# EAGLE design 4-HCloverMedallion (EAGLE 7.5.0)
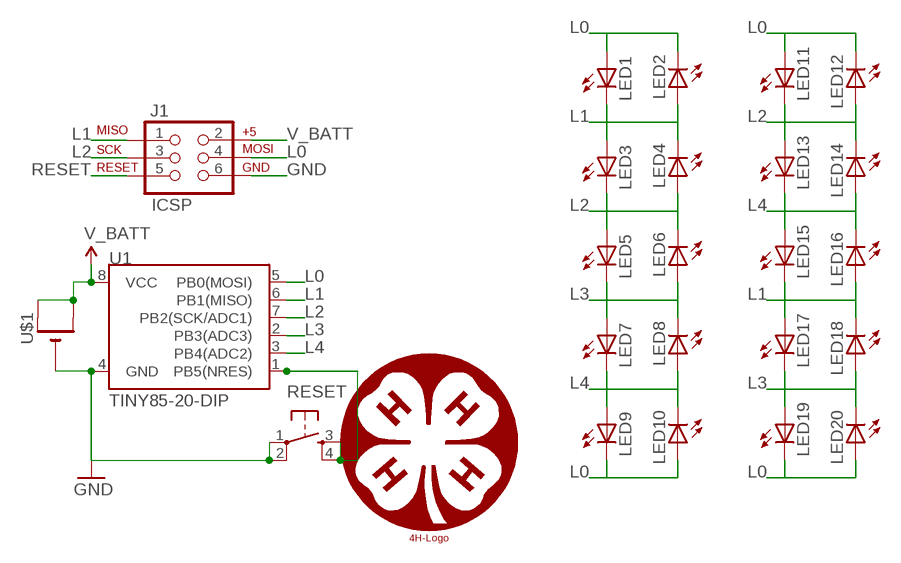
[diagram p0: schematic, sheet 1]

## Parts
J1  ICSP  AVR_SPI_PRG_6LABELED  [2X3-NS]
LED1  LED5MM  [LED5MM]
LED2  LED5MM  [LED5MM]
LED3  LED5MM  [LED5MM]
LED4  LED5MM  [LED5MM]
LED5  LED5MM  [LED5MM]
LED6  LED5MM  [LED5MM]
LED7  LED5MM  [LED5MM]
LED8  LED5MM  [LED5MM]
LED9  LED5MM  [LED5MM]
LED10  LED5MM  [LED5MM]
LED11  LED5MM  [LED5MM]
LED12  LED5MM  [LED5MM]
LED13  LED5MM  [LED5MM]
LED14  LED5MM  [LED5MM]
LED15  LED5MM  [LED5MM]
LED16  LED5MM  [LED5MM]
LED17  LED5MM  [LED5MM]
LED18  LED5MM  [LED5MM]
LED19  LED5MM  [LED5MM]
LED20  LED5MM  [LED5MM]
RESET  TAC_SWITCHPTH  [TACTILE-PTH]
U1  TINY85-20-DIP  ATTINY45TINY85-20-DIP  [DIP08]
U$1  CR2032THM  [CR2032-THRU]
U$2  4H-LOGO14  [4H_LOGO_14]

## Nets
GND: J1.6(GND) RESET.1 RESET.2 U1.4(GND) U$1.-
L0: J1.4(MOSI) LED1.A LED2.K(C) LED9.K(C) LED10.A LED11.A LED12.K(C) LED19.K(C) LED20.A U1.5(PB0(MOSI))
L1: J1.1(MISO) LED1.K(C) LED2.A LED3.A LED4.K(C) LED15.K(C) LED16.A LED17.A LED18.K(C) U1.6(PB1(MISO))
L2: J1.3(SCK) LED3.K(C) LED4.A LED5.A LED6.K(C) LED11.K(C) LED12.A LED13.A LED14.K(C) U1.7(PB2(SCK/ADC1))
L3: LED5.K(C) LED6.A LED7.A LED8.K(C) LED17.K(C) LED18.A LED19.A LED20.K(C) U1.2(PB3(ADC3))
L4: LED7.K(C) LED8.A LED9.A LED10.K(C) LED13.K(C) LED14.A LED15.A LED16.K(C) U1.3(PB4(ADC2))
RESET: J1.5(RST) RESET.3 RESET.4 U1.1(PB5(NRES))
V_BATT: J1.2(V+) U1.8(VCC) U$1.+1(+) U$1.+2(+1)

## Library data of the parts
J1 = barbary_enterprises:AVR_SPI_PRG_6: AVR ISP 6 Pin This is the reduced ISP connector for AVR programming. Common on Arduino. This footprint will take up less PCB space and can be used with a 10-pin to 6-pin adapter such as SKU: BOB-08508
LED1-LED20 = SparkFun-LED:LED: LEDs Standard schematic elements and footprints for 5mm, 3mm, 1206, and 0603 sized LEDs. 5mm - Spark Fun Electronics SKU : COM-00529 (and others)
RESET = barbary_enterprises:TAC_SWITCH: Momentary Switch Button commonly used for reset or general input. Spark Fun Electronics SKU : COM-00097 SMT- SWCH-08247
U1 = SparkFun-DigitalIC:ATTINY45: Atmel 8-pin 2/4/8kB flash uC; PROD_ID: IC-09445
U$1 = battery:CR2032
U$2 = 4h:4H-LOGO: 18 USC 707 R=51, G=153, B=102 #339966

## Board
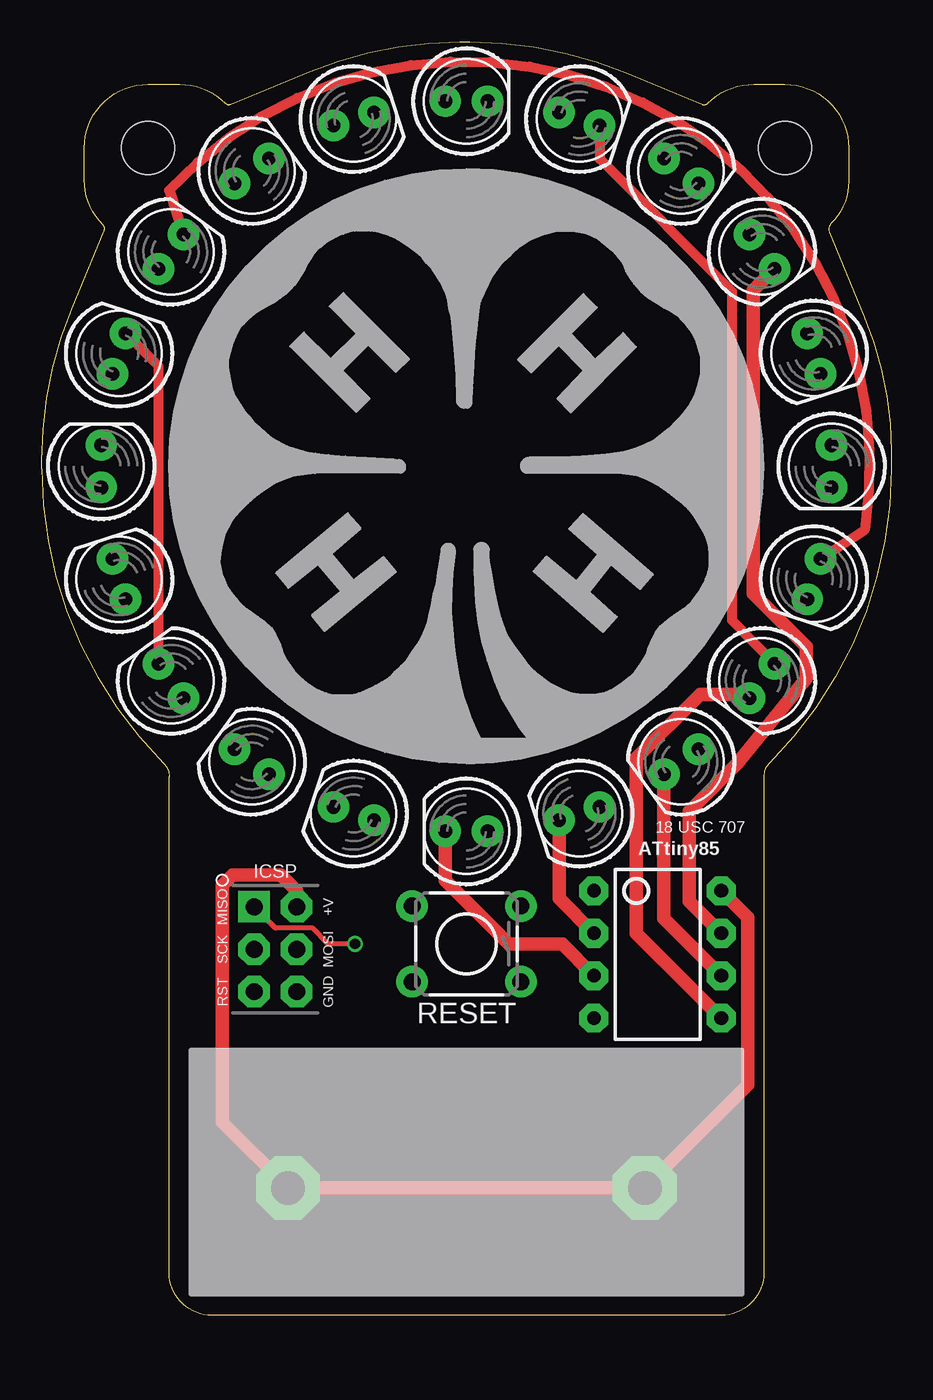
[diagram p1: board, top side]
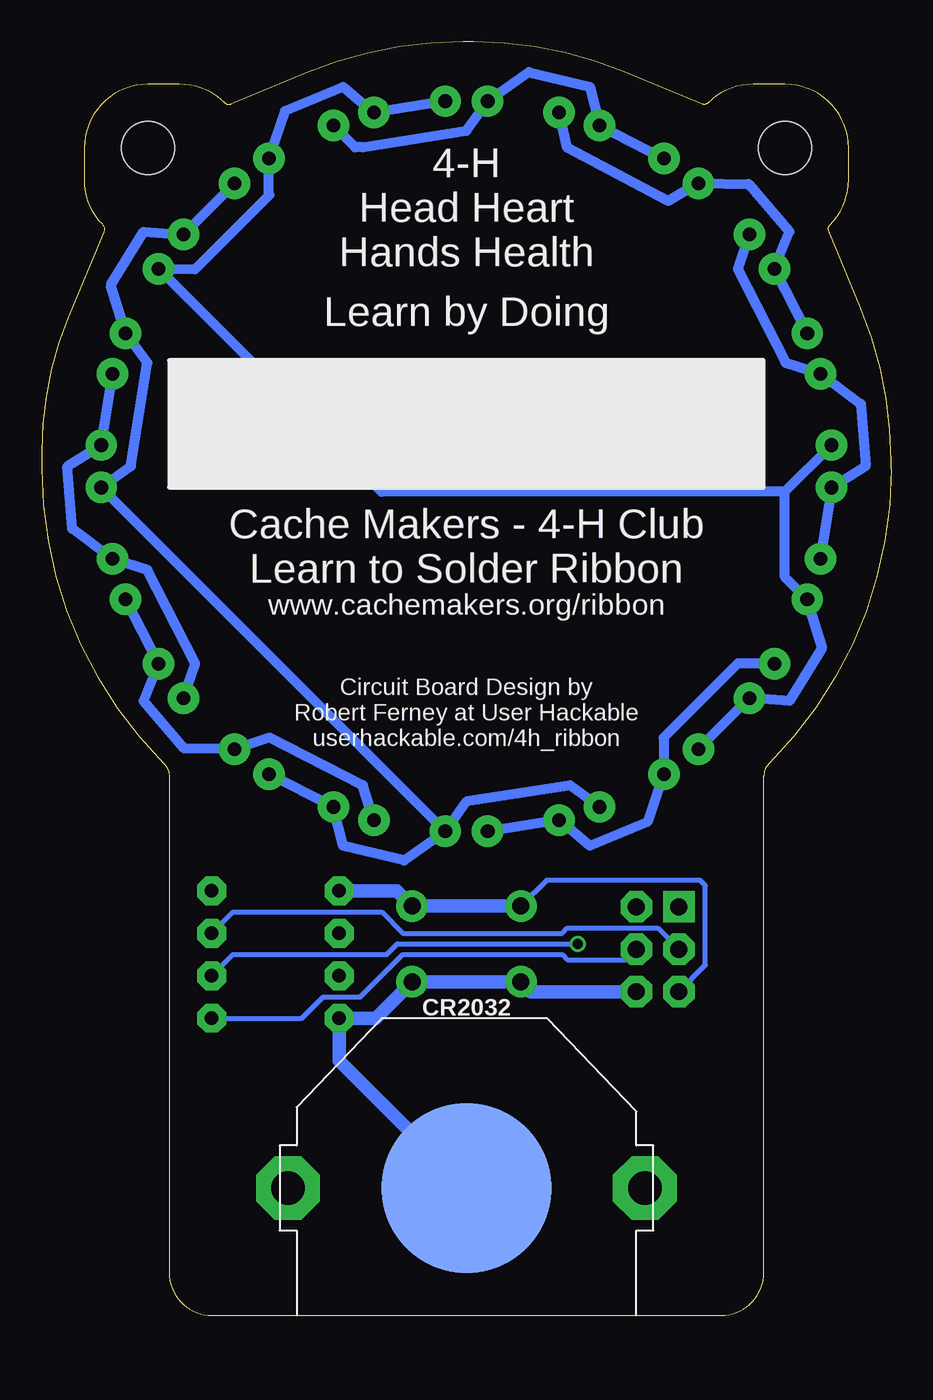
[diagram p2: board, bottom side, seen from below]

Size 50.8 x 76.2 mm. Coordinates in mm from the lower left corner, seen from the top.
Outline: 43.18,32.25 43.18,2.54 arc-90 40.64,0 10.16,0 arc-90 7.62,2.54 7.62,32.25 arc45 7.3,33.02 arc-45 0,50.65 0,51.14 arc-23 1.82,60.27 3.73,64.9 arc67 3.66,65.24 arc-45 2.54,67.95 2.54,69.85 arc-90 6.35,73.66 8.25,73.66 arc-45 10.96,72.54 arc67 11.3,72.47 15.99,74.41 arc-22 25,76.2 25.61,76.2 arc-22 34.96,74.34 39.51,72.46 arc67 39.84,72.52 arc-45 42.58,73.66 44.45,73.66 arc-90 48.26,69.85 48.26,67.87 arc-45 47.2,65.3 arc67 47.1,64.81 49.2,59.73 arc-22 50.8,51.7 50.8,50.65 arc-45 43.5,33.02 arc45 43.18,32.25
Copper layers (1*16): Top 0.0356mm / dielectric 1.5011mm / Bottom 0.0356mm
Design rules "LaenPCBOrder": minimum track width 6mil, minimum drill 13mil, track to track 6mil, track to pad 6mil, pad to pad 6mil, via to via 6mil, smd to smd 6mil, copper to edge 15mil, drill to drill 6mil, minimum pad ring 7mil, minimum via ring 7mil, stop-mask expansion 3mil, vias tented up to drill 0mil, thermal gap 10mil
Holes 3.17 mm at 6.35,69.85 44.45,69.85

### Footprints (pad centres in the part's own frame; a part is rotated, then mirrored left to right if it is on the bottom)
2X3-NS = drill 1.016 pad 1.88 square: 1 -2.54,-1.27 | drill 1.016 pad 1.88 octagon: 2 -2.54,1.27; 3 0,-1.27; 4 0,1.27; 5 2.54,-1.27; 6 2.54,1.27
LED5MM = drill 0.813 pad 1.88: A -1.27,0; K 1.27,0
TACTILE-PTH = drill 1.016 pad 1.88: 1 -3.251,2.261; 2 3.251,2.261; 3 -3.251,-2.261; 4 3.251,-2.261
DIP08 = drill 0.813 pad 1.727 octagon: 1 -3.81,-3.81; 2 -1.27,-3.81; 3 1.27,-3.81; 4 3.81,-3.81; 5 3.81,3.81; 6 1.27,3.81; 7 -1.27,3.81; 8 -3.81,3.81
CR2032-THRU = drill 2 pad 3.81 octagon: +1 -10.668,0; +2 10.668,0 | smd 10.16 x 10.16: - 0,0

### Placement (x,y rotation side)
J1  13.97,21.91 270 top
LED1  47.24,50.8 270 top
LED2  46.17,57.55 288 top
LED3  43.07,63.64 306 top
LED4  38.24,68.47 324 top
LED5  32.15,71.57 342 top
LED6  25.4,72.64 0 top
LED7  18.65,71.57 18 top
LED8  12.56,68.47 36 top
LED9  7.73,63.64 54 top
LED10  4.63,57.55 72 top
LED11  3.56,50.8 90 top
LED12  4.63,44.05 108 top
LED13  7.73,37.96 126 top
LED14  12.56,33.13 144 top
LED15  18.65,30.03 162 top
LED16  25.4,28.96 180 top
LED17  32.15,30.03 198 top
LED18  38.24,33.13 216 top
LED19  43.07,37.96 234 top
LED20  46.17,44.05 252 top
RESET  25.4,22.23 180 top
U1  36.83,21.59 270 top
U$1  25.4,7.62 180 bottom
U$2  25.4,50.8 0 top

### Tracks (layer width: path | path; a pad name or v marks a point on that pad's centre or on a via)
GND
  Bottom 0.813: U$1.- 33.02,15.24 U1.4 30.84,17.78 RESET.1 RESET.2 21.55,19.37 J1.6
L0
  Top 0.61: LED9.K 7.62,67.31 arc-146 49.21,46.99 LED20.A
  Top 0.813: U1.5 35.56,22.86 35.56,33.34 39.37,37.15 42.11,37.15 LED19.K
  Bottom 0.305: U1.5 35.24,17.78 33.97,19.05 31.75,19.05 29.21,21.59 19.68,21.59 19.37,21.27 15.88,21.27 J1.4
  Bottom 0.61: LED19.K 41.63,39.01 44.48,44.6 LED20.A 48.98,47.06 49.28,50.8 LED1.A LED2.K | LED9.K 9.17,62.59 6.32,57 LED10.A 1.82,54.53 1.52,50.8 LED11.A LED12.K
L1  (via drill 0.6)
  Top 0.305: v18.73,22.23 17.14,22.23 16.19,23.18 13.97,23.18 J1.1
  Top 0.813: LED18.K 37.21,23.75 U1.6
  Bottom 0.305: v18.73,22.23 29.53,22.23 30.16,21.59 39.37,21.59 U1.6
  Bottom 0.61: LED4.K LED3.A 44.72,64.83 46.67,61.64 LED2.A 44.48,57 45.47,50.8 LED1.K LED16.A | LED15.K 19.2,31.72 25.4,30.73 LED16.A | LED16.A 29.14,27.22 32.78,28.09 LED17.A LED18.K
L2
  Top 0.813: U1.7 38.73,24.77 38.73,30.16 41.59,33.02 45.72,38.1 45.72,40.01 42.55,43.18 42.55,61.34 LED3.K
  Bottom 0.305: J1.3 13.97,23.18 19.37,23.18 19.68,22.86 29.21,22.86 30.48,24.13 39.37,24.13 U1.7
  Bottom 0.61: LED6.K LED5.A 32.78,73.51 36.24,72.07 LED4.A 37.21,67.05 37.19,67.03 41.63,62.59 LED3.K 30.48,49.28 6.35,49.28 | LED14.K LED13.A 6.08,36.77 4.13,39.96 LED12.A 6.35,44.17 6.35,49.28 | 6.35,49.28 LED11.K
L3
  Top 0.61: 17.78,70.84 LED7.A | LED5.K 33.36,69.19 41.27,61.28 41.27,41.59 LED19.A
  Top 0.813: U1.2 30.94,24.94 LED17.K
  Bottom 0.61: LED20.K LED19.A 44.72,36.77 42.28,33.92 LED18.A 37.19,34.57 31.6,31.72 LED17.K | LED8.K LED7.A 18.02,73.51 21.66,74.38 LED6.A 25.4,70.87 31.6,69.88 32.06,69.88 LED5.K
L4
  Top 0.61: LED13.K 6.98,56.79 LED10.K
  Top 0.813: U1.3 31.11,22.23 27.94,22.23 24.13,26.04 LED16.K
  Bottom 0.61: LED10.K LED9.A 6.08,64.83 8.52,67.68 LED8.A 13.34,66.67 19.37,69.85 LED7.K | LED13.K 9.17,39.01 13.61,34.57 LED14.A 14.56,29.53 18.02,28.09 LED15.A LED16.K
RESET
  Bottom 0.305: J1.5 11.11,20.95 11.11,25.72 11.43,26.04 20.6,26.04 RESET.4
  Bottom 0.813: RESET.4 RESET.3 29.57,25.4 U1.1
V_BATT
  Top 0.813: U1.8 42.23,23.81 42.23,13.78 U$1.+2 U$1.+1 10.79,11.56 10.79,25.72 11.43,26.35 14.29,26.35 15.24,25.4 J1.2

### Text on the board
tPlace: 18 USC 707 | ATtiny85 | ICSP
bPlace: 4-H / Head Heart / Hands Health | Learn by Doing | Cache Makers - 4-H Club / Learn to Solder Ribbon | www.cachemakers.org/ribbon | Circuit Board Design by / Robert Ferney at User Hackable / userhackable.com/4h_ribbon | CR2032